# EAGLE schematic schematic (EAGLE 9.5.1)
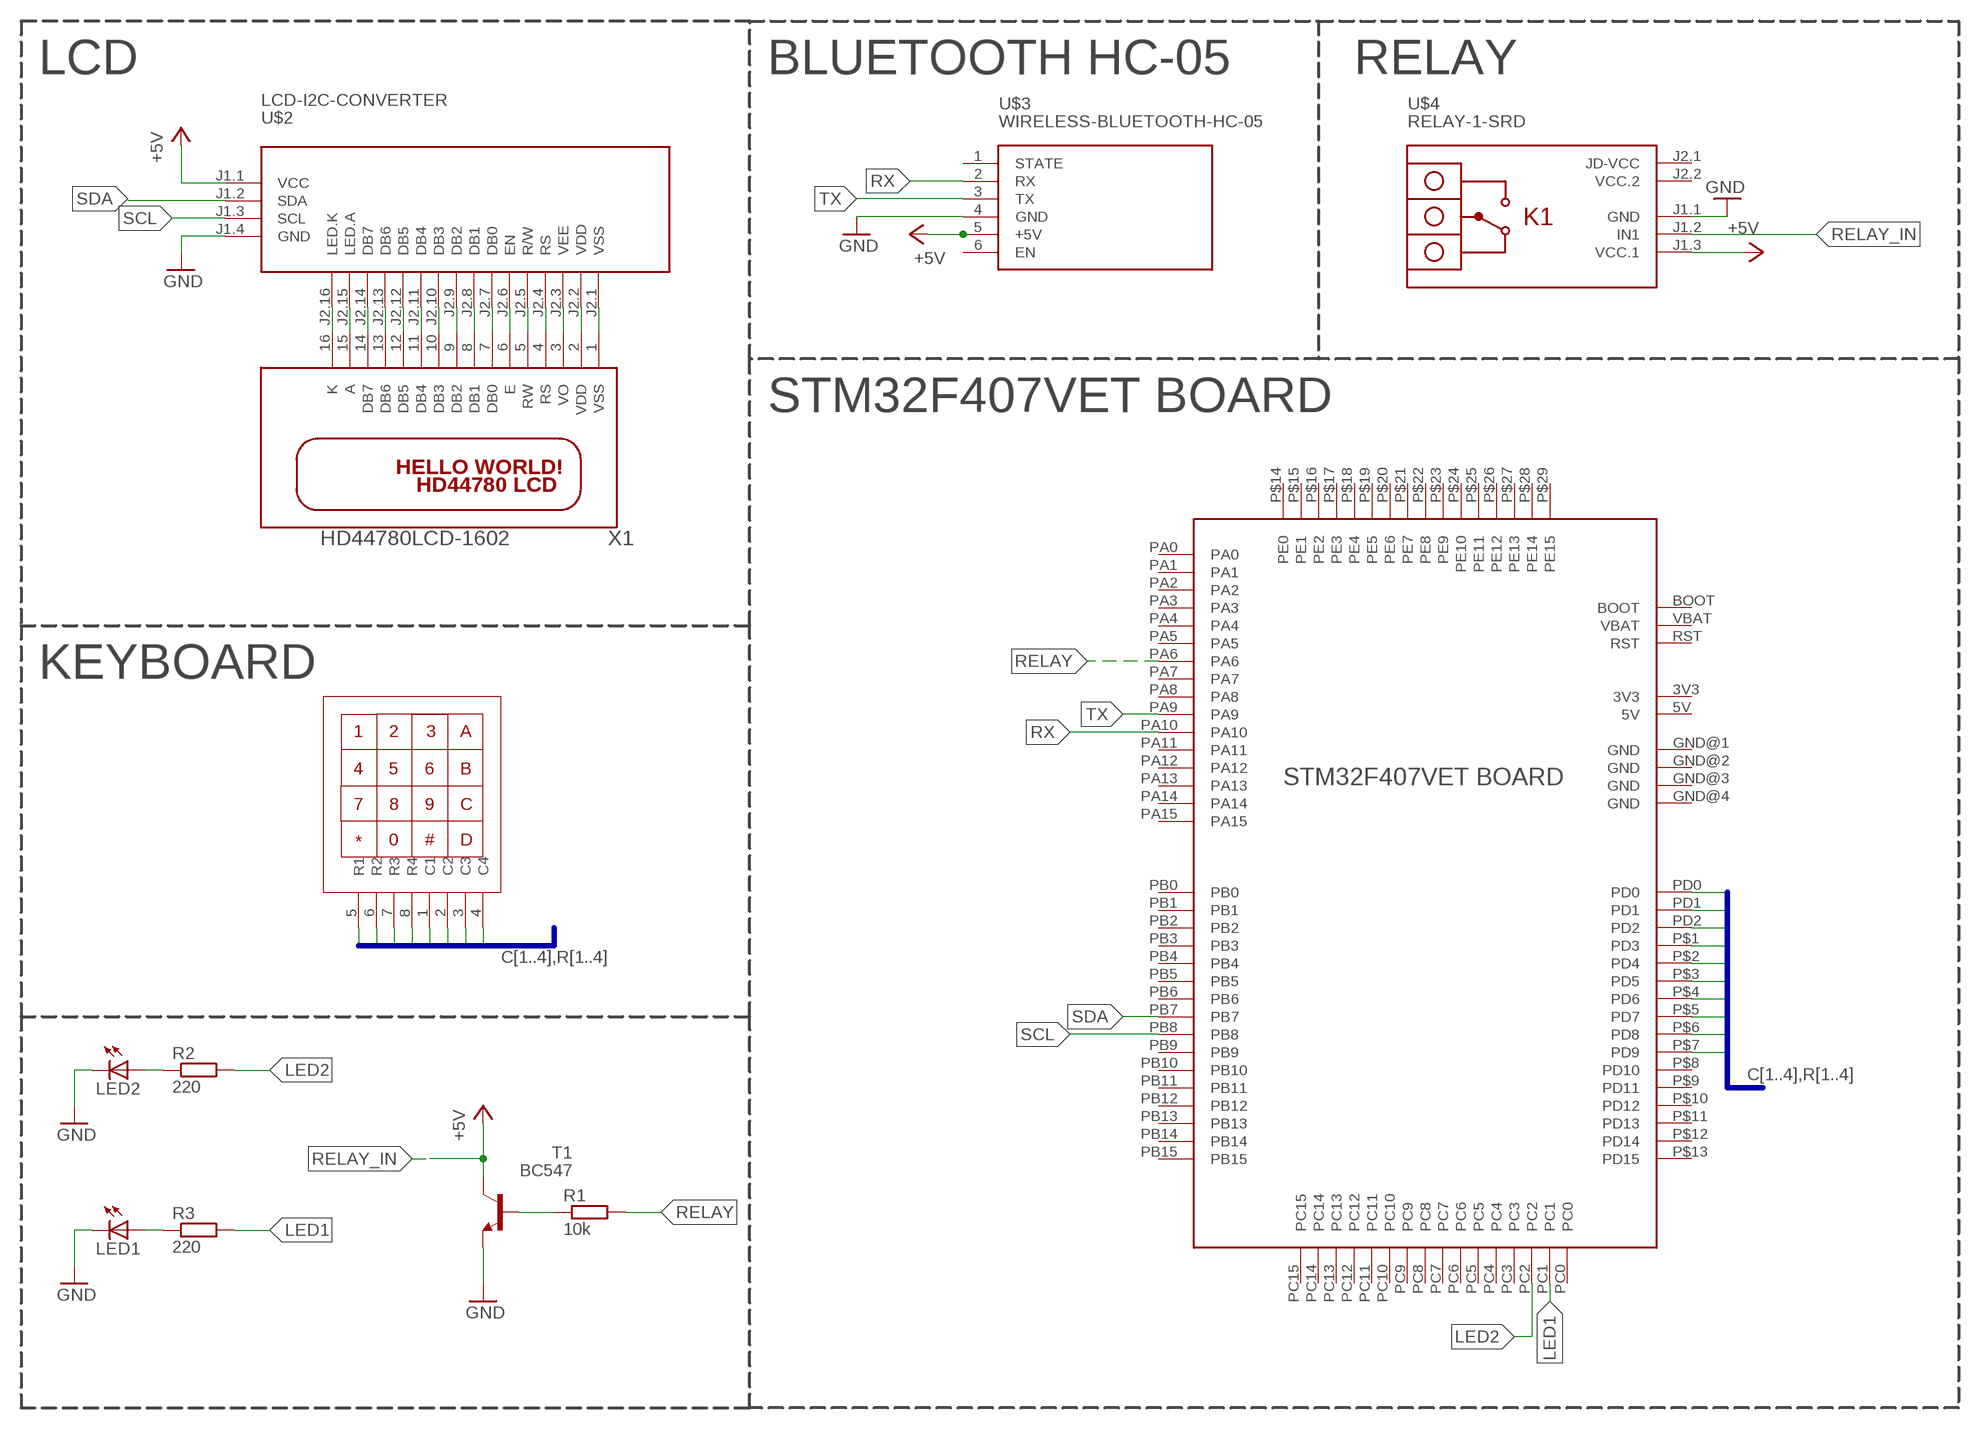
[diagram p0: schematic, sheet 1]

## Parts
LED1  LED  [SMARTLED-TTW]
LED2  LED  [SMARTLED-TTW]
R1  10k  R-EU_R1206  [R1206]
R2  220  R-EU_R1206  [R1206]
R3  220  R-EU_R1206  [R1206]
T1  BC547  [TO92]
U$1  KEYPAD4X4  [KEYPAD4X4]
U$2  LCD-I2C-CONVERTER  [LCD-I2C-CONVERTER]
U$3  WIRELESS-BLUETOOTH-HC-05  [WIRELESS-BLUETOOTH-HC-05]
U$4  RELAY-1-SRD  [RELAY-1-SRD]
U$5  STM32_DISCOVERY  [STM32_DISCOVERY]
X1  HD44780LCD-1602  [LCD1602]

## Nets
+5V: U$2.J1.1(VCC) U$3.5(+5V)
C1: U$1.1(C1) U$5.P$3(PD5) U$5.P$4(PD6)
C2: U$1.2(C2) U$5.P$5(PD7)
C3: U$1.3(C3) U$5.P$6(PD8)
C4: U$1.4(C4) U$5.P$7(PD9)
GND: LED1.C@1(C) LED2.C@1(C) T1.1(E) U$2.J1.4(GND) U$3.4(GND) U$4.J1.1(GND)
LED1: R3.2 U$5.PC1
LED2: R2.2 U$5.PC2
N$1: U$2.J2.16(LED.K) X1.16(K)
N$2: U$2.J2.15(LED.A) X1.15(A)
N$3: U$2.J2.14(DB7) X1.14(DB7)
N$4: U$2.J2.13(DB6) X1.13(DB6)
N$5: U$2.J2.12(DB5) X1.12(DB5)
N$6: U$2.J2.11(DB4) X1.11(DB4)
N$7: U$2.J2.10(DB3) X1.10(DB3)
N$8: U$2.J2.9(DB2) X1.9(DB2)
N$9: U$2.J2.8(DB1) X1.8(DB1)
N$10: U$2.J2.7(DB0) X1.7(DB0)
N$11: U$2.J2.6(EN) X1.6(E)
N$12: U$2.J2.5(R/W) X1.5(RW)
N$13: U$2.J2.4(RS) X1.4(RS)
N$14: U$2.J2.3(VEE) X1.3(VO)
N$15: R1.1 T1.2(B)
N$17: LED2.A@1(A) R2.1
N$18: LED1.A@1(A) R3.1
R1: U$1.5(R1) U$5.PD0
R2: U$1.6(R2) U$5.PD1
R3: U$1.7(R3) U$5.P$1(PD3) U$5.PD2
R4: U$1.8(R4) U$5.P$2(PD4)
RELAY: R1.2 U$5.PA6
RELAY_IN: T1.3(C) U$4.J1.2(IN1) U$4.J1.3(VCC.1) ; supply symbol labelled +5V
RX: U$3.2(RX) U$5.PA10
SCL: U$2.J1.3(SCL) U$5.PB8
SDA: U$2.J1.2(SDA) U$5.PB7
TX: U$3.3(TX) U$5.PA9
VDD: U$2.J2.2(VDD) X1.2(VDD)
VSS: U$2.J2.1(VSS) X1.1(VSS)
Unconnected: U$3.1(STATE) U$3.6(EN) U$4.J2.1(JD-VCC) U$5.3V3 U$5.5V U$5.BOOT U$5.GND@1(GND) U$5.GND@2(GND) U$5.GND@3(GND) U$5.GND@4(GND) U$5.NC@1(NC) U$5.NC@2(NC) U$5.P$8(PD10) U$5.P$9(PD11) U$5.P$10(PD12) U$5.P$11(PD13) U$5.P$12(PD14) U$5.P$13(PD15) U$5.P$14(PE0) U$5.P$15(PE1) U$5.P$16(PE2) U$5.P$17(PE3) U$5.P$18(PE4) U$5.P$19(PE5) U$5.P$20(PE6) U$5.P$21(PE7) U$5.P$22(PE8) U$5.P$23(PE9) U$5.P$24(PE10) U$5.P$25(PE11) U$5.P$26(PE12) U$5.P$27(PE13) U$5.P$28(PE14) U$5.P$29(PE15) U$5.PA0 U$5.PA1 U$5.PA2 U$5.PA3 U$5.PA4 U$5.PA5 U$5.PA7 U$5.PA8 U$5.PA11 U$5.PA12 U$5.PA13 U$5.PA14 U$5.PA15 U$5.PB0 U$5.PB1 U$5.PB2 U$5.PB3 U$5.PB4 U$5.PB5 U$5.PB6 U$5.PB9 U$5.PB10 U$5.PB11 U$5.PB12 U$5.PB13 U$5.PB14 U$5.PB15 U$5.PC0 U$5.PC3 U$5.PC4 U$5.PC5 U$5.PC6 U$5.PC7 U$5.PC8 U$5.PC9 U$5.PC10 U$5.PC11 U$5.PC12 U$5.PC13 U$5.PC14 U$5.PC15 U$5.RST U$5.VBAT

## Buses
C[1..4],R[1..4]

## Notes on the sheet
- LCD | BLUETOOTH HC-05 | RELAY
- STM32F407VET BOARD
- KEYBOARD
- STM32F407VET BOARD

## Power pins joined to a net without a drawn wire
VCC.2: U$4.J2.2(VCC.2)

## Library data of the parts
LED1 LED2 = adafruit:LED: LED OSRAM: - CHIPLED LG R971, LG N971, LY N971, LG Q971, LY Q971, LO R971, LY R971 LH N974, LH R974 LS Q976, LO Q976, LY Q976 LO Q996 - Hyper CHIPLED LW Q18S LB Q993, LB Q99A, LB R99A - SideLED LS A670, LO A670, LY A670, LG A670, LP A670 LB A673, LV A673, LT A673, LW A673 LH A674 LY A675 LS A676, LA A676, LO A676, LY A676, LW A676 LS A679, LY A679, LG A679 - Hyper Micro SIDELED® LS Y876, LA Y876, LO Y876, LY Y876 LT Y87S - SmartLED LW L88C, LW L88S LB L89C, LB L89S, LG L890 LS L89K, LO L89K, LY L89K LS L896, LA L896, LO L896, LY L896 - TOPLED LS T670, LO T670, LY T670, LG T670, LP T670 LSG T670, LSP T670, LSY T670, LOP T670, LYG T670 LG T671, LOG T671, LSG T671 LB T673, LV T673, LT T673, LW T673 LH T674 LS T676, LA T676, LO T676, LY T676, LB T676, LH T676, LSB T676, LW T676 LB T67C, LV T67C, LT T67C, LS T67K, LO T67K, LY T67K, LW E67C LS E67B, LA E67B, LO E67B, LY E67B, LB E67C, LV E67C, LT E67C LW T67C LS T679, LY T679, LG T679 LS T770, LO T770, LY T770, LG T770, LP T770 LB T773, LV T773, LT T773, LW T773 LH T774 LS E675, LA E675, LY E675, LS T675 LS T776, LA T776, LO T776, LY T776, LB T776 LHGB T686 LT T68C, LB T68C - Hyper Mini TOPLED® LB M676 - Mini TOPLED Santana® LG M470 LS M47K, LO M47K, LY M47K Source: http://www.osram.convergy.de/
R1-R3 = resistor:R-EU_: RESISTOR, European symbol
T1 = transistor:BC547: NPN TRANSISTOR
U$1 = keypad_4x4_raw:KEYPAD4X4
U$2 = diy-modules:LCD-I2C-CONVERTER: I2C Bus to 4-Bit Parallel LCD Interface with LED backlight driver
U$3 = diy-modules:WIRELESS-BLUETOOTH-HC-05: Bluetooth Transceiver Module based on HC-05 board Tutorial is available here: https://arduino-info.wikispaces.com/BlueTooth-HC05-HC06-Modules-How-To Click here to find device on ebay.com <http://www.ebay.com/sch/hc-05+module+rs232>
U$4 = diy-modules:RELAY-1-SRD: 1-Channel Relay Module based on SRD-05VDC-SL-C relays Click here to find device on ebay.com <http://www.ebay.com/sch/one+channel+isolated+relay+5v>
U$5 = stm32_discovery:STM32_DISCOVERY: STM32 Value line discovery
X1 = adafruit:HD44780LCD: HD44780 LCD Standard character type LCDs, available in sizes from 8x1 to 40x4!